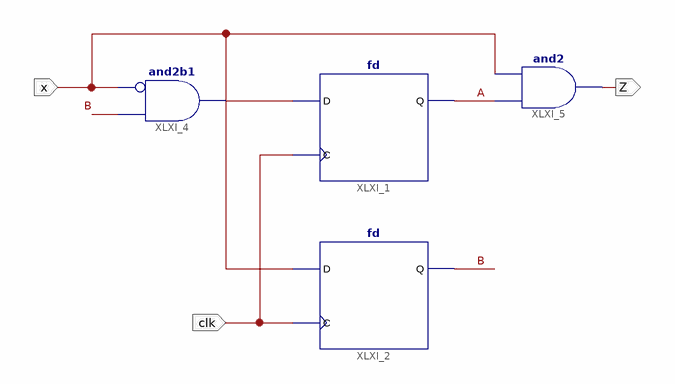
[diagram p0: schematic sheet 1]
// Xilinx ISE schematic FSM.sch (xc9500) as structural Verilog: 4 symbols, 3 ports
module FSM (
  input  clk,
  input  x,
  output Z
);

  wire A, B, XLXN_8;

  fd XLXI_1 (.C(clk), .D(XLXN_8), .Q(A));
  fd XLXI_2 (.C(clk), .D(x), .Q(B));
  and XLXI_4 (XLXN_8, ~x, B);  // and2b1
  and XLXI_5 (Z, x, A);
endmodule
